# Altium schematic sheet Peripherial.SchDoc
size A
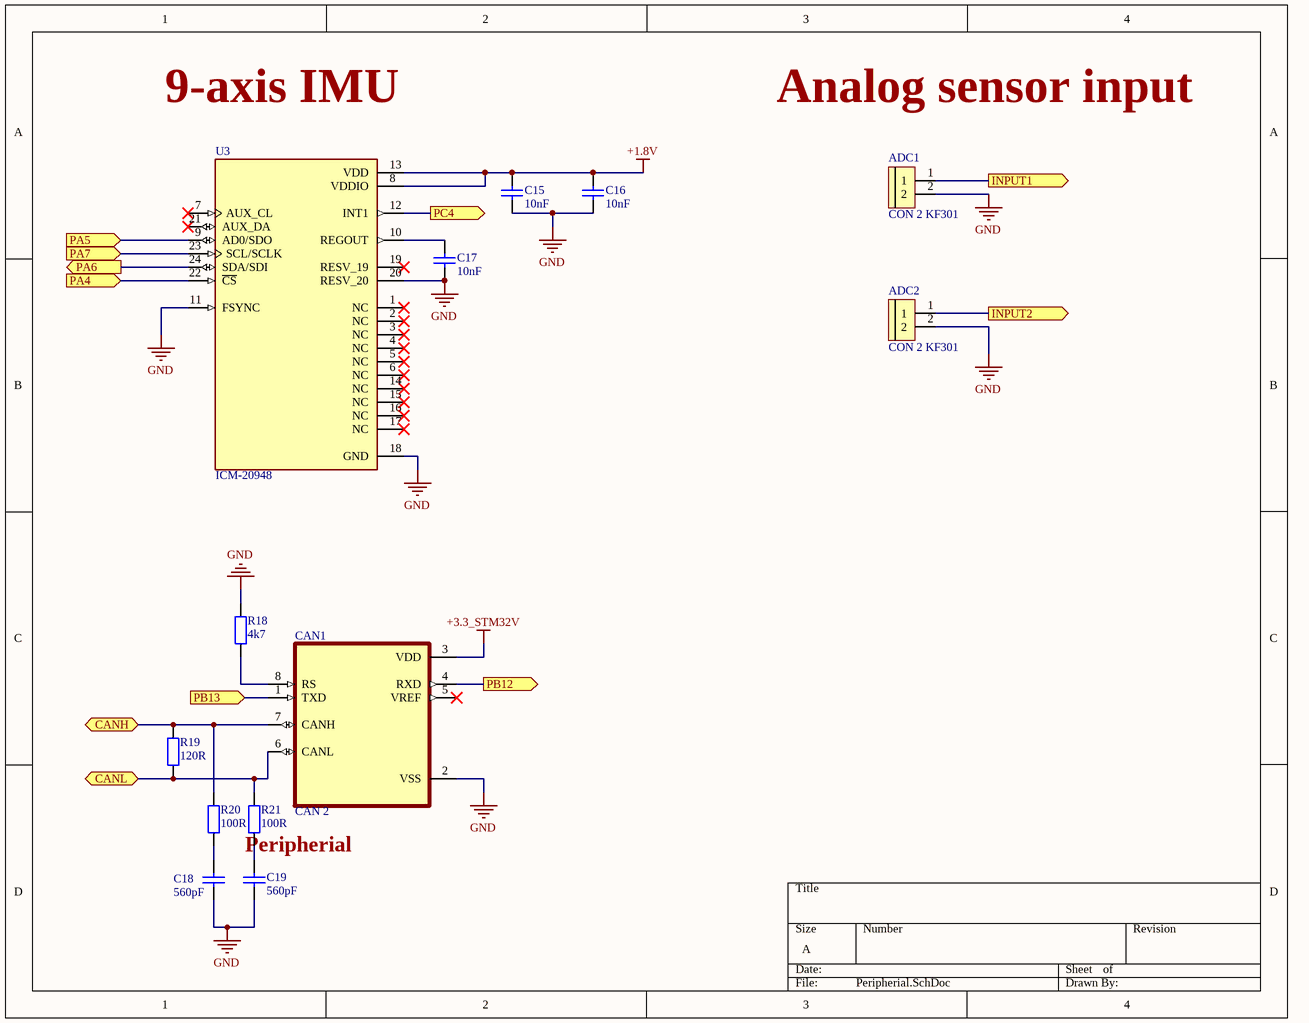
[diagram p0: Peripherial.SchDoc]

## Parts
ADC1  CON 2 KF301  [Con 2 KF301 5.08]
ADC2  CON 2 KF301  [Con 2 KF301 5.08]
C15  10nF  [tu 0805]
C16  10nF  [tu 0805]
C17  10nF  [tu 0805]
C18  560pF  [tu 0805]
C19  560pF  [tu 0805]
CAN1  CAN 2  [SOIC127P599X175-8N]
R18  4k7  [tro smd 0805]
R19  120R  [tro smd 0805]
R20  100R  [tro smd 0805]
R21  100R  [tro smd 0805]
U3  ICM-20948  [QFN40P300X300X105-24N]

## Ports
CANH (bidir), CANL (bidir), INPUT1 (out), INPUT2 (out), PA4 (in), PA5 (in), PA6 (out), PA7 (in), PB12 (out), PB13 (in), PC4 (out)

## Nets
+1.8V: C15.1 C16.1 U3.8(VDDIO) U3.13(VDD)
+3.3_STM32V: CAN1.3(VDD)
GND: ADC1.2 ADC2.2 C15.2 C16.2 C17.2 C18.2 C19.2 CAN1.2(VSS) R18.1 U3.11(FSYNC) U3.18(GND) U3.20(RESV_20)
CANH: CAN1.7(CANH) R19.2 R20.2 ; port CANH
CANL: CAN1.6(CANL) R19.1 R21.2 ; port CANL
INPUT1: ADC1.1 ; port INPUT1
INPUT2: ADC2.1 ; port INPUT2
PA4: U3.22(~{CS}) ; port PA4
PA5: U3.9(AD0/SDO) ; port PA5
PA6: U3.24(SDA/SDI) ; port PA6
PA7: U3.23(SCL/SCLK) ; port PA7
PB12: CAN1.4(RXD) ; port PB12
PB13: CAN1.1(TXD) ; port PB13
PC4: U3.12(INT1) ; port PC4
NetC17_1: C17.1 U3.10(REGOUT)
NetC18_1: C18.1 R20.1
NetC19_1: C19.1 R21.1
NetCAN1_8: CAN1.8(RS) R18.2

Not connected (* = marked no-connect by the designer): CAN1 5(VREF)*; U3 1(NC)* 2(NC)* 3(NC)* 4(NC)* 5(NC)* 6(NC)* 7(AUX_CL)* 14(NC)* 15(NC)* 16(NC)* 17(NC)* 19(RESV_19)* 21(AUX_DA)*

## Notes on the sheet
- 9-axis IMU
- Analog sensor input
- (near R21) Peripherial

## Library data of the parts
ADC1 ADC2 = CON 2 KF301: Cắm; Ma_Hang: MH000987; Ten_Linh_Kien: CON 2 KF301-2P 5.08MM Xanh Dương; Chung_Loai: Cắm; Ghi_Chu: *; Kieu_Chan: *; Don_Vi: Con
C15-C19 = Tu 0805 106 16V 10%: Dán; Ten_Linh_Kien: Tụ 0805 106-10uF 10% 16V; So_Chan: 2; Don_Vi: Con; Ma_Hang: MH004553; Chung_Loai: Dán; Kieu_Chan: *
CAN1 = MCP2551-I/SN: MF: {'manufacturer': u'Microchip Technology'}; Package: None; Price: None; Value: *; MP: MCP2551-I/SN; Availability: Unavailable
R18-R21 = Tro 0805 1% 10k: Dán; Don_Vi: Con; So_Chan: 2; Ten_Linh_Kien: Trở 0805 1% 10k; Ma_Hang: MH005473; Chung_Loai: Dán; Kieu_Chan: *
U3 = ICM-20948: Accelerometer, Gyroscope, Magnetometer, 9 Axis Sensor IÂ²C, SPI Output; Package: None; Value: *; Price: None; MP: ICM-20948; Availability: Unavailable